# EAGLE schematic olm-flora-sqw-long (EAGLE 6.5.0)
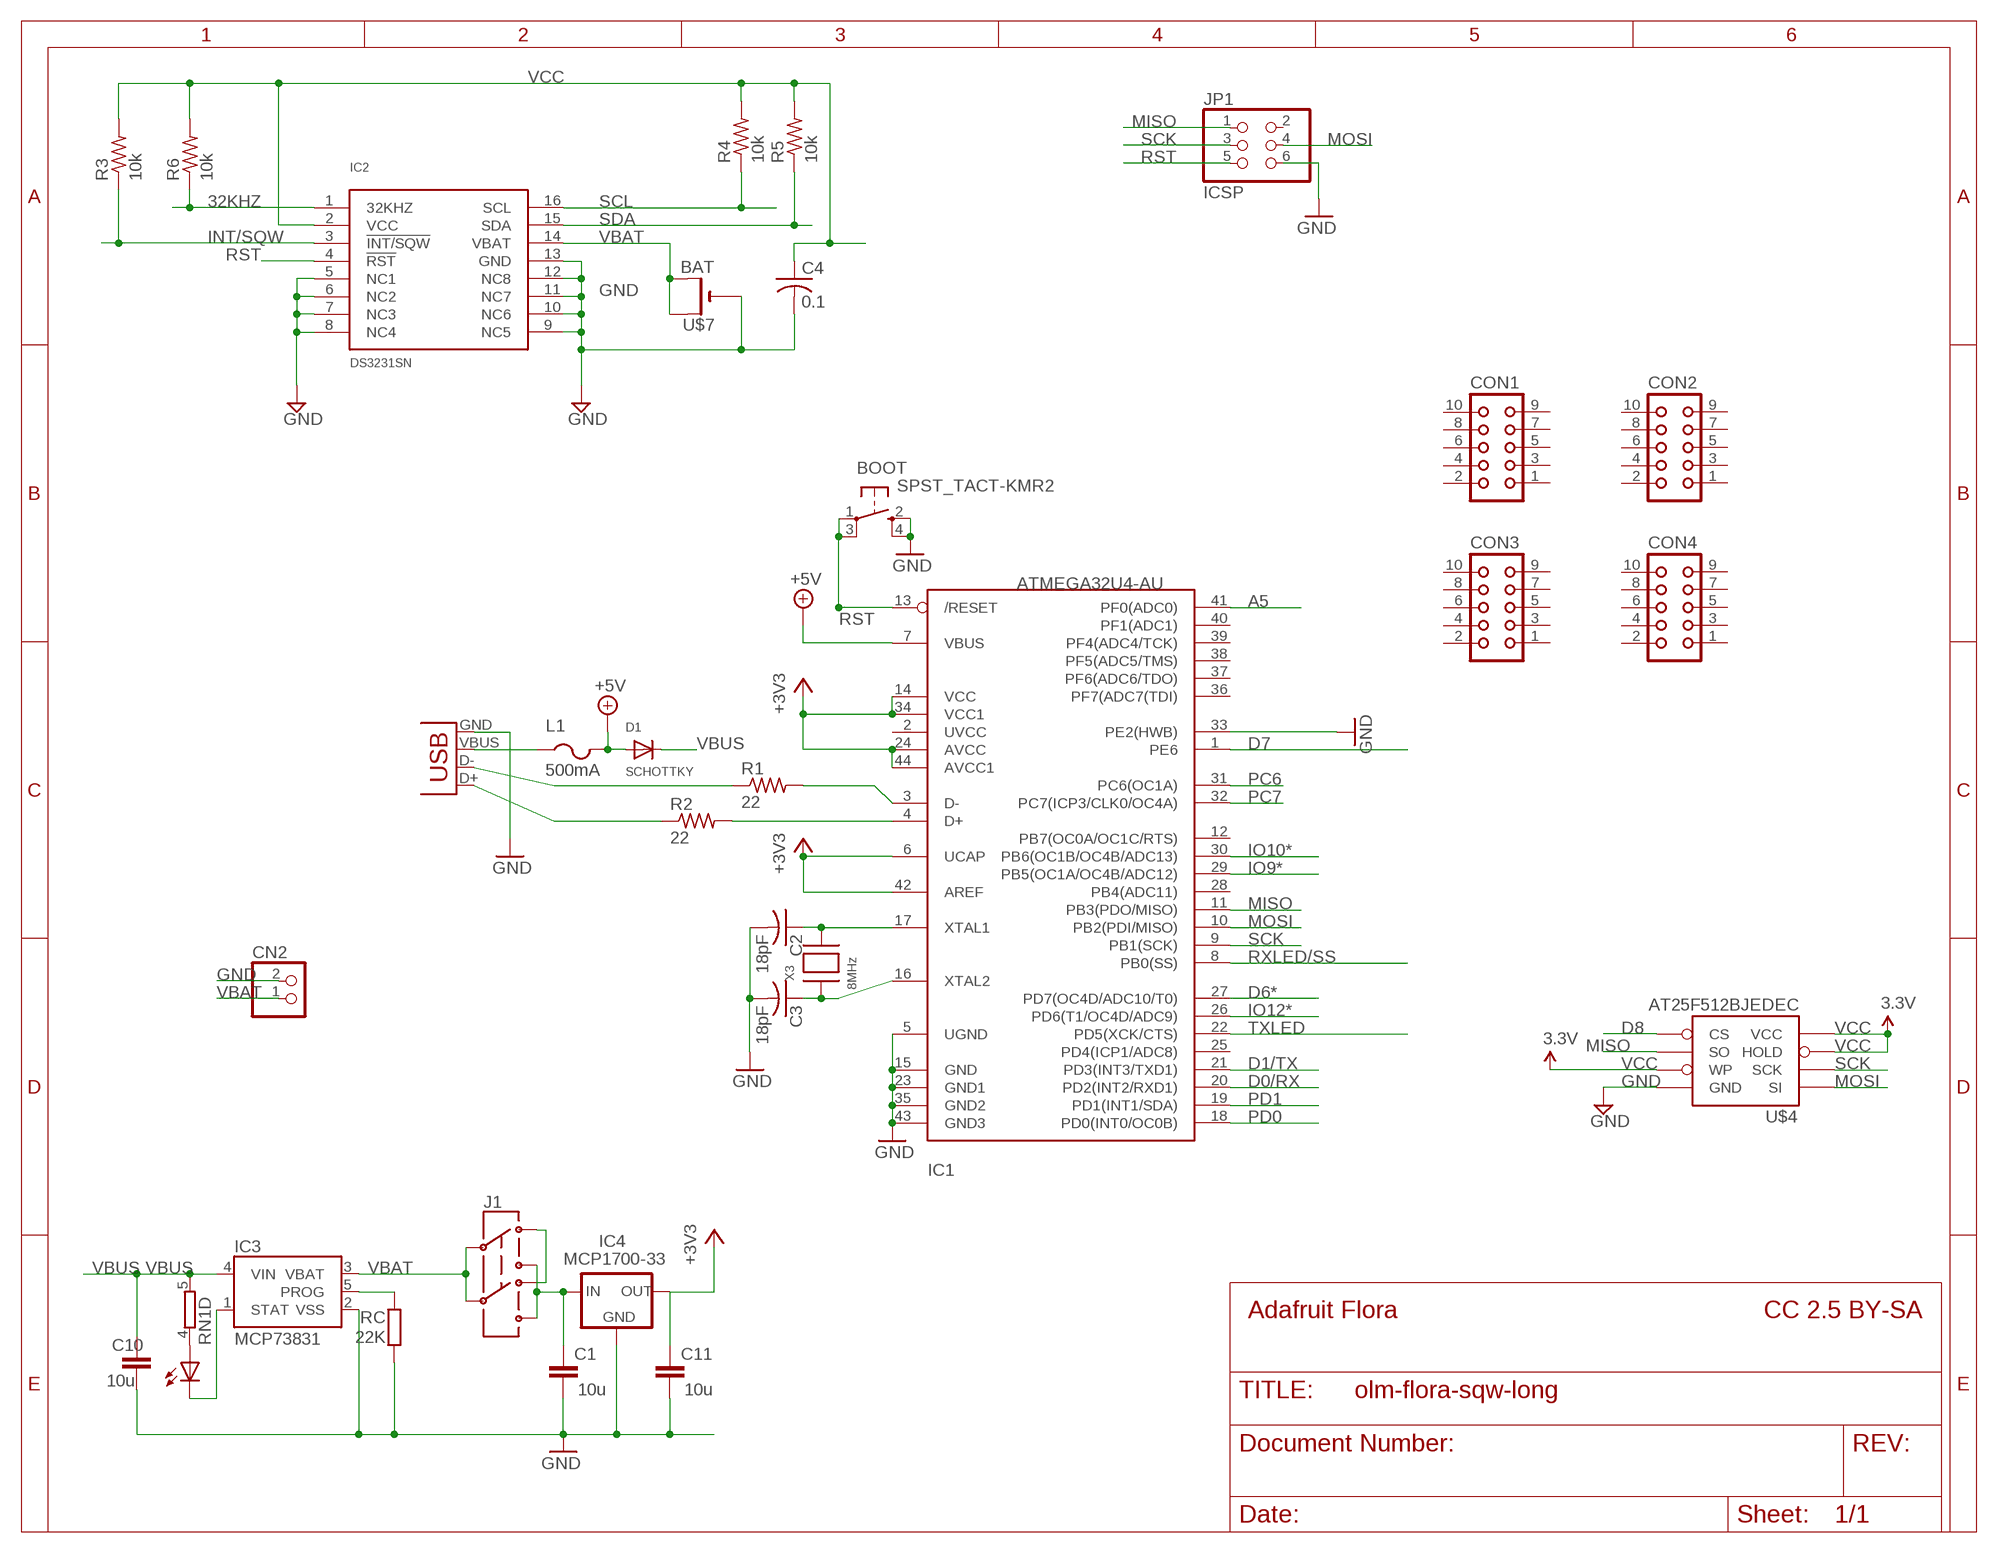
[diagram p0: schematic, sheet 1]

## Parts
BOOT  SPST_TACT-KMR2  [KMR2]
C1  10u  C-EUC0805  [C0805]
C2  18pF  C-USC0805K  [C0805K]
C3  18pF  C-USC0805K  [C0805K]
C4  0.1  C-USC0805K  [C0805K]
C10  10u  C-EUC0805  [C0805]
C11  10u  C-EUC0805  [C0805]
CHG  0805  LEDCHIPLED_0805  [CHIPLED_0805]
CN2  JST_2PIN-SMT-RA  [JST-PH-2-SMT-RA]
CON1  CON10  [CON10]
CON2  CON10  [CON10]
CON3  CON10  [CON10]
CON4  CON10  [CON10]
D1  SCHOTTKY  DIODESOD-123  [SOD-123]
IC1  ATMEGA32U4-AU  [TQFP44]
IC2  DS3231SN  [SO16W]
IC3  MCP73831  [SOT23-5]
IC4  MCP1700-33  MCP1700SOT233  [SOT23]
J1  AYZ0202  [AYZ0202]
JP1  ICSP  PINHD-2X3  [2X03]
L1  500mA  PTCFUSE-1206  [R1206]
R1  22  R-US_R0805  [R0805]
R2  22  R-US_R0805  [R0805]
R3  10k  R-US_R0805  [R0805]
R4  10k  R-US_R0805  [R0805]
R5  10k  R-US_R0805  [R0805]
R6  10k  R-US_R0805  [R0805]
RC  22K  R-EU_R0805  [R0805]
RN1  4R-NEXB38V  [EXB38V]
U$4  AT25F512BJEDEC  [SO08]
U$7  BAT  CR1220SMT  [CR1220-SMD]
X1  USBSMD  [USB-MINIB]
X3  8MHz  XTALNX5032  [NX5032]

## Nets
32KHZ: IC2.1(32KHZ) R6.1
+3V3: C11.1 IC1.6(UCAP) IC1.14(VCC) IC1.24(AVCC) IC1.34(VCC1) IC1.42(AREF) IC1.44(AVCC1) IC4.2(OUT)
+5V: D1.A IC1.7(VBUS) L1.2
A5: IC1.41(PF0(ADC0))
D0/RX: IC1.20(PD2(INT2/RXD1))
D1/TX: IC1.21(PD3(INT3/TXD1))
D6*: IC1.27(PD7(OC4D/ADC10/T0))
D7: IC1.1(PE6)
D8: U$4.1_CS(CS)
GND: BOOT.2(S) BOOT.4(S1) C1.2 C2.2 C3.2 C4.2 C10.2 C11.2 CN2.2 IC1.5(UGND) IC1.15(GND) IC1.23(GND1) IC1.33(PE2(HWB)) IC1.35(GND2) IC1.43(GND3) IC2.5(NC1) IC2.6(NC2) IC2.7(NC3) IC2.8(NC4) IC2.9(NC5) IC2.10(NC6) IC2.11(NC7) IC2.12(NC8) IC2.13(GND) IC3.2(VSS) IC4.1(GND) JP1.6 RC.1 U$4.4_GND(GND) U$7.- X1.GND
INT/SQW: IC2.3(!INT/SQW) R3.1
IO9*: IC1.29(PB5(OC1A/OC4B/ADC12))
IO10*: IC1.30(PB6(OC1B/OC4B/ADC13))
IO12*: IC1.26(PD6(T1/OC4D/ADC9))
MISO: IC1.11(PB3(PDO/MISO)) JP1.1 U$4.2_SO(SO)
MOSI: IC1.10(PB2(PDI/MISO)) JP1.4 U$4.5_SI(SI)
N$1: CHG.C IC3.1(STAT)
N$2: R2.1 X1.D+
N$3: IC1.3(D-) R1.2
N$4: IC1.4(D+) R2.2
N$5: R1.1 X1.D-
N$8: C2.1 IC1.17(XTAL1) X3.P$2
N$9: C3.1 IC1.16(XTAL2) X3.P$1
N$10: IC3.5(PROG) RC.2
N$11: J1.3 J1.6
N$12: CHG.A RN1.4
PC6: IC1.31(PC6(OC1A))
PC7: IC1.32(PC7(ICP3/CLK0/OC4A))
PD0: IC1.18(PD0(INT0/OC0B))
PD1: IC1.19(PD1(INT1/SDA))
RST: BOOT.1(P) BOOT.3(P1) IC1.13(/RESET) IC2.4(!RST) JP1.5
RXLED/SS: IC1.8(PB0(SS))
SCK: IC1.9(PB1(SCK)) JP1.3 U$4.6_SCK(SCK)
SCL: IC2.16(SCL) R4.1
SDA: IC2.15(SDA) R5.1
TXLED: IC1.22(PD5(XCK/CTS))
VBAT: CN2.1 IC2.14(VBAT) IC3.3(VBAT) J1.2 J1.5 U$7.+$1(+) U$7.+$2(+1)
VBUS: C10.1 D1.C IC3.4(VIN) L1.1 RN1.5 X1.VBUS
VCC: C4.1 IC2.2(VCC) R3.2 R4.2 R5.2 R6.2 U$4.3_WP(WP) U$4.7_HOLD(HOLD) U$4.8_VCC(VCC) ; supply symbol labelled 3.3V
VDD: C1.1 IC4.3(IN) J1.1 J1.4
Unconnected: CON1.1 CON1.2 CON1.3 CON1.4 CON1.5 CON1.6 CON1.7 CON1.8 CON1.9 CON1.10 CON2.1 CON2.2 CON2.3 CON2.4 CON2.5 CON2.6 CON2.7 CON2.8 CON2.9 CON2.10 CON3.1 CON3.2 CON3.3 CON3.4 CON3.5 CON3.6 CON3.7 CON3.8 CON3.9 CON3.10 CON4.1 CON4.2 CON4.3 CON4.4 CON4.5 CON4.6 CON4.7 CON4.8 CON4.9 CON4.10 IC1.2(UVCC) IC1.12(PB7(OC0A/OC1C/RTS)) IC1.25(PD4(ICP1/ADC8)) IC1.28(PB4(ADC11)) IC1.36(PF7(ADC7(TDI)) IC1.37(PF6(ADC6/TDO)) IC1.38(PF5(ADC5/TMS)) IC1.39(PF4(ADC4/TCK)) IC1.40(PF1(ADC1)) JP1.2 RN1.1 RN1.2 RN1.3 RN1.6 RN1.7 RN1.8

## Notes on the sheet
- Adafruit Flora | CC 2.5 BY-SA

## Library data of the parts
BOOT = adafruit:SPST_TACT: SMT 6mm switch, EVQQ2 series http://www.ladyada.net/library/eagle
C1 C10 C11 = resistor:C-EU: CAPACITOR, European symbol
C2-C4 = adafruit:C-US: CAPACITOR, American symbol
CHG = led:LED: LED OSRAM: - CHIPLED LG R971, LG N971, LY N971, LG Q971, LY Q971, LO R971, LY R971 LH N974, LH R974 LS Q976, LO Q976, LY Q976 LO Q996 - Hyper CHIPLED LW Q18S LB Q993, LB Q99A, LB R99A - SideLED LS A670, LO A670, LY A670, LG A670, LP A670 LB A673, LV A673, LT A673, LW A673 LH A674 LY A675 LS A676, LA A676, LO A676, LY A676, LW A676 LS A679, LY A679, LG A679 - Hyper Micro SIDELED® LS Y876, LA Y876, LO Y876, LY Y876 LT Y87S - SmartLED LW L88C, LW L88S LB L89C, LB L89S, LG L890 LS L89K, LO L89K, LY L89K LS L896, LA L896, LO L896, LY L896 - TOPLED LS T670, LO T670, LY T670, LG T670, LP T670 LSG T670, LSP T670, LSY T670, LOP T670, LYG T670 LG T671, LOG T671, LSG T671 LB T673, LV T673, LT T673, LW T673 LH T674 LS T676, LA T676, LO T676, LY T676, LB T676, LH T676, LSB T676, LW T676 LB T67C, LV T67C, LT T67C, LS T67K, LO T67K, LY T67K, LW E67C LS E67B, LA E67B, LO E67B, LY E67B, LB E67C, LV E67C, LT E67C LW T67C LS T679, LY T679, LG T679 LS T770, LO T770, LY T770, LG T770, LP T770 LB T773, LV T773, LT T773, LW T773 LH T774 LS E675, LA E675, LY E675, LS T675 LS T776, LA T776, LO T776, LY T776, LB T776 LHGB T686 LT T68C, LB T68C - Hyper Mini TOPLED® LB M676 - Mini TOPLED Santana® LG M470 LS M47K, LO M47K, LY M47K Source: http://www.osram.convergy.de LUXEON: - LUMILED® LXK2-PW12-R00, LXK2-PW12-S00, LXK2-PW14-U00, LXK2-PW14-V00 LXK2-PM12-R00, LXK2-PM12-S00, LXK2-PM14-U00 LXK2-PE12-Q00, LXK2-PE12-R00, LXK2-PE12-S00, LXK2-PE14-T00, LXK2-PE14-U00 LXK2-PB12-K00, LXK2-PB12-L00, LXK2-PB12-M00, LXK2-PB14-N00, LXK2-PB14-P00, LXK2-PB14-Q00 LXK2-PR12-L00, LXK2-PR12-M00, LXK2-PR14-Q00, LXK2-PR14-R00 LXK2-PD12-Q00, LXK2-PD12-R00, LXK2-PD12-S00 LXK2-PH12-R00, LXK2-PH12-S00 LXK2-PL12-P00, LXK2-PL12-Q00, LXK2-PL12-R00 Source: www.luxeon.com KINGBRIGHT: KA-3528ASYC Source: www.kingbright.com
CN2 = adafruit:JST_2PIN: JST 2-Pin Connectors of various flavors SMT-RA (S2B-PH-SM4) 4UConnector #17311 SMT (B2B-PH-SM4) THM-RA (S2B-PH) THM (B2B-PH)
CON1-CON4 = con-harting:CON10: CONNECTOR; OC_FARNELL: unknown; OC_NEWARK: unknown
D1 = adafruit:DIODE: Diode SMADIODE - SMA Surface Mount Package 20V 1A Schottky Diode Digikey: 641-1014-6-ND DO-1N4148 - Through Hole Small Current Diode SOD-123 20V 1 A (.5mV Vf) Schottky Diode - Digikey: MBRX120TPMSCT-ND SOD-323 10V 570mA (.38mV Vf, 3ns) Schottky Diode - Digikey: ZLLS410CT-ND SOD-523 30V 30mA Schottky Diode (RB751S-40TE61) - Digikey: RB751S-40TE61CT-ND SOT23-R/W - SOT23 Package (R = Solder Paste/Reflow Ovens, W = Hand-Soldering) BAT54Film 40V 300mA - Digikey: 497-7162-1-ND
IC1 = adaprog:ATMEGA32U4
IC2 = comfile:DS3231SN
IC3 = SparkFunNew:MCP73831: Microchip's MCP73831 Miniature single cell, fully integrated Li-Ion, Li-polymer charge management controller http://ww1.microchip.com/downloads/en/DeviceDoc/21984a.pdf
IC4 = adafruit:MCP1700: VOLTAGE REGULATOR
J1 = SparkFunNew:AYZ0202: SPDT Slide Switch Simple SMD single-pull double-throw slide switch. Good for less than 350mA power switch, switching UARTs between devices, etc. Spark Fun Electronics SKU : COM-00597
JP1 = pinhead:PINHD-2X3: PIN HEADER
L1 = adafruit:PTCFUSE: PTC fuses, resettable thermistors
R1-R6 = adafruit:R-US_: RESISTOR, American symbol
RC = rcl:R-EU_: RESISTOR, European symbol
RN1 = resistor-dil:4R-N: Array Chip Resistor Source: RS Component / Phycomp; OC_FARNELL: unknown; OC_NEWARK: unknown
U$4 = LowPowerLab:AT25F512B: 4-Mbit SPI flash memory
U$7 = adafruit:CR1220: CR1216/CR1220/CR1225 12mm 3V lithium coin cell Great for battery packup. Both SMT and THM holders. Note the THM package has the ground pads on both sides of the PCB so that the masks are the same - this reduces the cost
X1 = SparkFun:USB: USB Connectors USB-B-PTH is fully proven SKU : PRT-00139 USB-miniB is fully proven SKU : PRT-00587 USB-A-PCB is untested. USB-A-H is throughly reviewed, but untested. Spark Fun Electronics SKU : PRT-00437 USB-B-SMT is throughly reviewed, but untested. Needs silkscreen touching up. USB-A-S has not been used/tested USB-MB-H has not been used/tested
X3 = adaprog:XTAL

## Net classes
1 power: width 0.203 mm, clearance 0.152 mm